# Altium project Printing.PrjPcb (part 1 of 4)
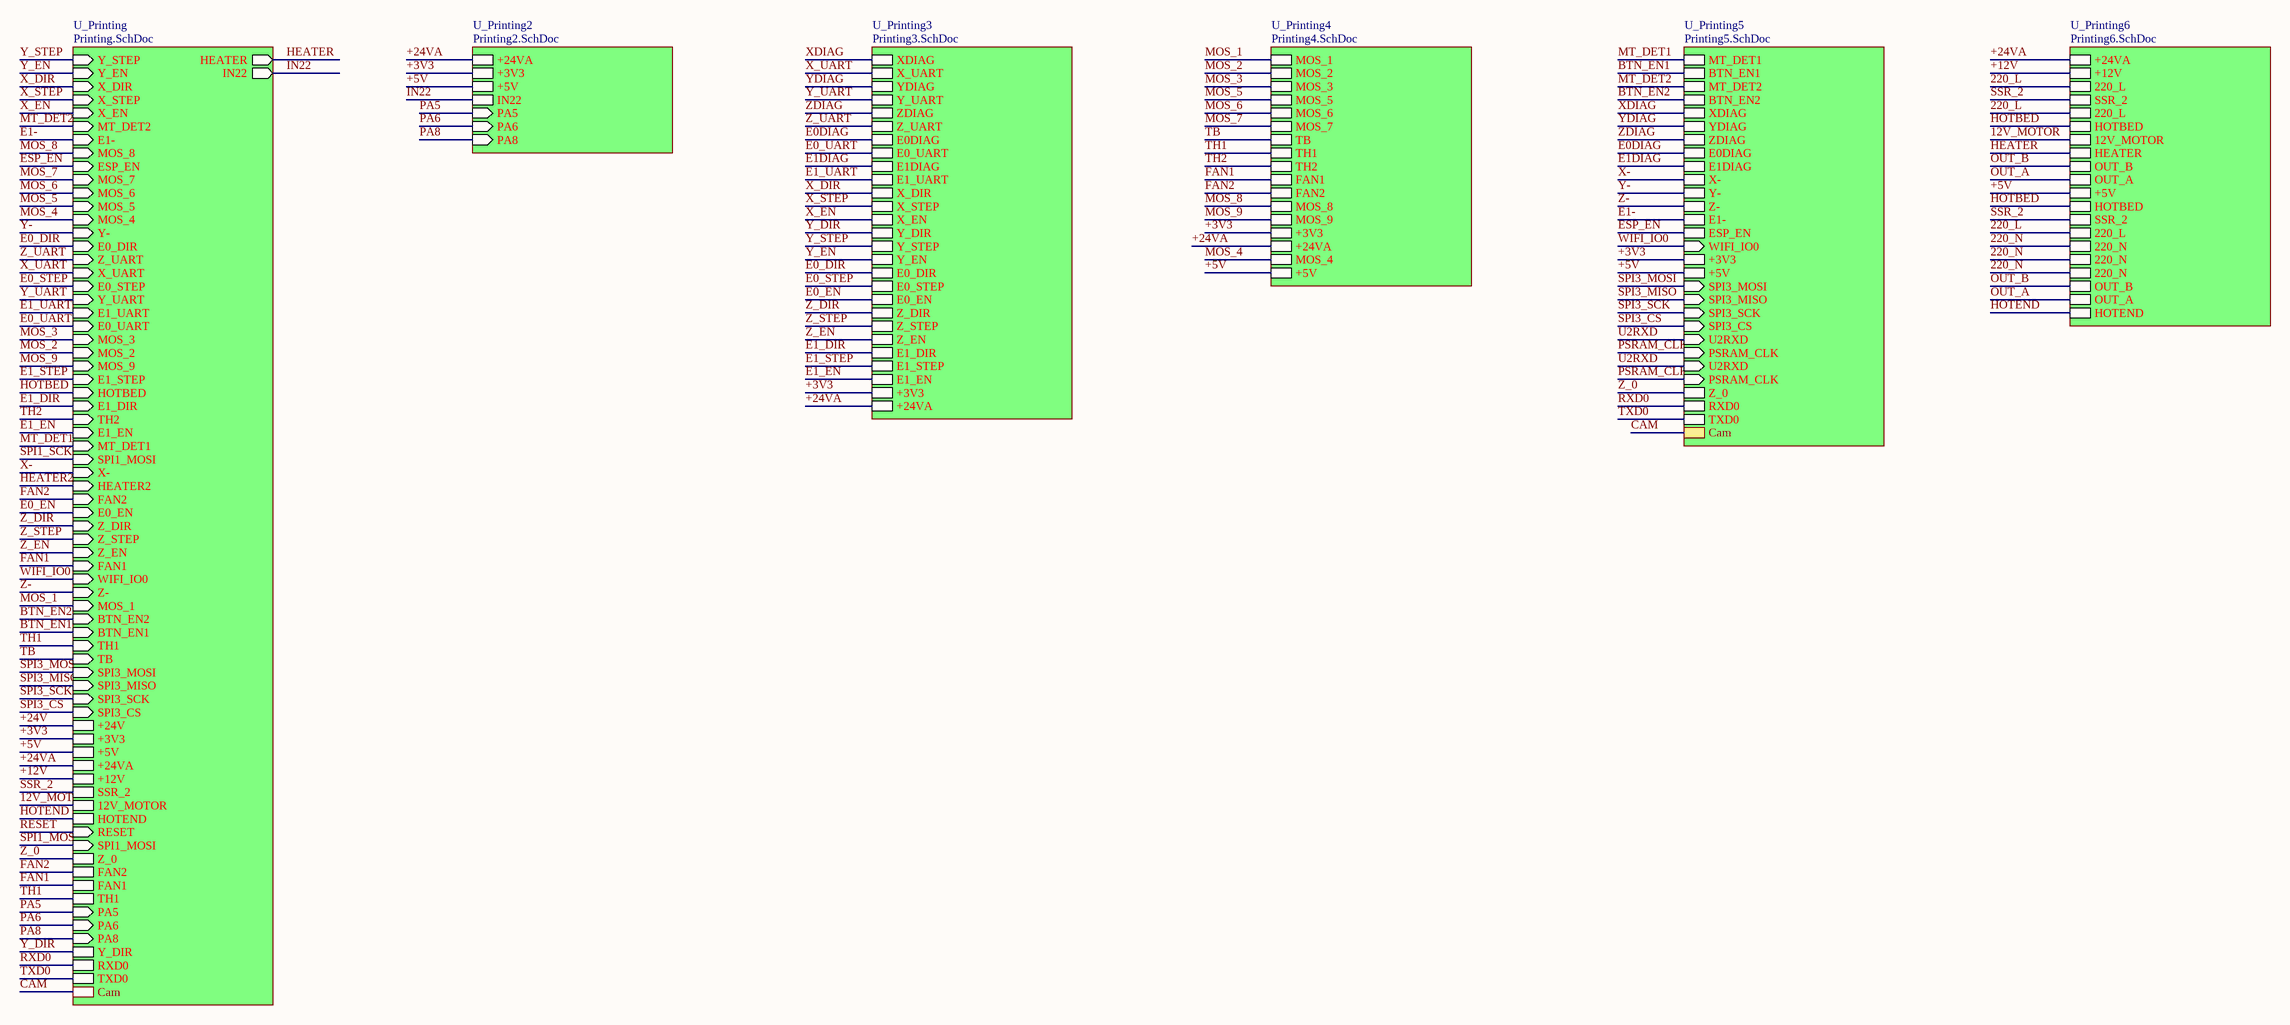
[diagram p0: Main-Sch.SchDoc]
7 sheets, 445 parts. Net scope: hierarchical (ports join the sheet entries above them; power ports are global).
Board files: Printing2.PcbDoc, Printing.PcbDoc
Sheets:
  Main-Sch.SchDoc
    U_Printing2 = Printing2.SchDoc
    U_Printing3 = Printing3.SchDoc
    U_Printing4 = Printing4.SchDoc
    U_Printing6 = Printing6.SchDoc
    U_Printing = Printing.SchDoc
    U_Printing5 = Printing5.SchDoc

## Sheet Main-Sch.SchDoc
size A2; Organization: Altium Limited; Address1: L3, 12a Rodborough Rd; Address2: Frenchs Forest; Address3: NSW; Address4: Australia 2086

### Sub-sheets
U_Printing = Printing.SchDoc: Y_STEP (in), Y_EN (in), X_DIR (in), X_STEP (in), X_EN (in), HEATER (out), MT_DET2 (in), E1- (in), MOS_8 (in), ESP_EN (in), MOS_7 (in), MOS_6 (in), MOS_5 (in), MOS_4 (in), Y- (in), E0_DIR (in), Z_UART (in), X_UART (in), E0_STEP (in), Y_UART (in), E1_UART (in), E0_UART (in), MOS_3 (in), MOS_2 (in), MOS_9 (in), E1_STEP (in), HOTBED (in), E1_DIR (in), TH2 (in), E1_EN (in), MT_DET1 (in), SPI1_MOSI (in), X- (in), HEATER2 (in), FAN2 (in), E0_EN (in), Z_DIR (in), Z_STEP (in), Z_EN (in), FAN1 (in), WIFI_IO0 (in), Z- (in), MOS_1 (in), BTN_EN2 (in), BTN_EN1 (in), TH1 (in), TB (in), IN22 (out), SPI3_MOSI (in), SPI3_MISO (in), SPI3_SCK (in), SPI3_CS (in), +24V, +3V3, +5V, +24VA, +12V, SSR_2, 12V_MOTOR, HOTEND, RESET (in), SPI1_MOSI (in), Z_0, FAN2, FAN1, TH1, PA5 (in), PA6 (in), PA8 (in), Y_DIR, RXD0, TXD0, Cam
U_Printing2 = Printing2.SchDoc: +24VA, +3V3, +5V, IN22, PA5 (in), PA6 (in), PA8 (in)
U_Printing3 = Printing3.SchDoc: XDIAG, X_UART, YDIAG, Y_UART, ZDIAG, Z_UART, E0DIAG, E0_UART, E1DIAG, E1_UART, X_DIR, X_STEP, X_EN, Y_DIR, Y_STEP, Y_EN, E0_DIR, E0_STEP, E0_EN, Z_DIR, Z_STEP, Z_EN, E1_DIR, E1_STEP, E1_EN, +3V3, +24VA
U_Printing4 = Printing4.SchDoc: MOS_1, MOS_2, MOS_3, MOS_5, MOS_6, MOS_7, TB, TH1, TH2, FAN1, FAN2, MOS_8, MOS_9, +3V3, +24VA, MOS_4, +5V
U_Printing5 = Printing5.SchDoc: MT_DET1, BTN_EN1, MT_DET2, BTN_EN2, XDIAG, YDIAG, ZDIAG, E0DIAG, E1DIAG, X-, Y-, Z-, E1-, ESP_EN, WIFI_IO0 (in), +3V3, +5V, SPI3_MOSI (in), SPI3_MISO (in), SPI3_SCK (in), SPI3_CS (in), U2RXD (in), PSRAM_CLK (in), U2RXD (in), PSRAM_CLK (in), Z_0, RXD0, TXD0, Cam
U_Printing6 = Printing6.SchDoc: +24VA, +12V, 220_L, SSR_2, 220_L, HOTBED, 12V_MOTOR, HEATER, OUT_B, OUT_A, +5V, HOTBED, SSR_2, 220_L, 220_N, 220_N, 220_N, OUT_B, OUT_A, HOTEND

### Nets
+3V3: sheet U_Printing2/+3V3, sheet U_Printing3/+3V3, sheet U_Printing4/+3V3, sheet U_Printing/+3V3, sheet U_Printing5/+3V3
+5V: sheet U_Printing2/+5V, sheet U_Printing4/+5V, sheet U_Printing6/+5V, sheet U_Printing/+5V, sheet U_Printing5/+5V
+12V: sheet U_Printing6/+12V, sheet U_Printing/+12V
+24VA: sheet U_Printing2/+24VA, sheet U_Printing3/+24VA, sheet U_Printing4/+24VA, sheet U_Printing6/+24VA, sheet U_Printing/+24VA
12V_MOTOR: sheet U_Printing6/12V_MOTOR, sheet U_Printing/12V_MOTOR
220_L: sheet U_Printing6/220_L, sheet U_Printing6/220_L, sheet U_Printing6/220_L
220_N: sheet U_Printing6/220_N, sheet U_Printing6/220_N, sheet U_Printing6/220_N
BTN_EN1: sheet U_Printing/BTN_EN1, sheet U_Printing5/BTN_EN1
BTN_EN2: sheet U_Printing/BTN_EN2, sheet U_Printing5/BTN_EN2
CAM: sheet U_Printing/Cam, sheet U_Printing5/Cam
E0_DIR: sheet U_Printing3/E0_DIR, sheet U_Printing/E0_DIR
E0_EN: sheet U_Printing3/E0_EN, sheet U_Printing/E0_EN
E0_STEP: sheet U_Printing3/E0_STEP, sheet U_Printing/E0_STEP
E0_UART: sheet U_Printing3/E0_UART, sheet U_Printing/E0_UART
E0DIAG: sheet U_Printing3/E0DIAG, sheet U_Printing5/E0DIAG
E1-: sheet U_Printing/E1-, sheet U_Printing5/E1-
E1_DIR: sheet U_Printing3/E1_DIR, sheet U_Printing/E1_DIR
E1_EN: sheet U_Printing3/E1_EN, sheet U_Printing/E1_EN
E1_STEP: sheet U_Printing3/E1_STEP, sheet U_Printing/E1_STEP
E1_UART: sheet U_Printing3/E1_UART, sheet U_Printing/E1_UART
E1DIAG: sheet U_Printing3/E1DIAG, sheet U_Printing5/E1DIAG
ESP_EN: sheet U_Printing/ESP_EN, sheet U_Printing5/ESP_EN
FAN1: sheet U_Printing4/FAN1, sheet U_Printing/FAN1, sheet U_Printing/FAN1
FAN2: sheet U_Printing4/FAN2, sheet U_Printing/FAN2, sheet U_Printing/FAN2
HEATER: sheet U_Printing6/HEATER, sheet U_Printing/HEATER
HOTBED: sheet U_Printing6/HOTBED, sheet U_Printing6/HOTBED, sheet U_Printing/HOTBED
HOTEND: sheet U_Printing6/HOTEND, sheet U_Printing/HOTEND
IN22: sheet U_Printing2/IN22, sheet U_Printing/IN22
MOS_1: sheet U_Printing4/MOS_1, sheet U_Printing/MOS_1
MOS_2: sheet U_Printing4/MOS_2, sheet U_Printing/MOS_2
MOS_3: sheet U_Printing4/MOS_3, sheet U_Printing/MOS_3
MOS_4: sheet U_Printing4/MOS_4, sheet U_Printing/MOS_4
MOS_5: sheet U_Printing4/MOS_5, sheet U_Printing/MOS_5
MOS_6: sheet U_Printing4/MOS_6, sheet U_Printing/MOS_6
MOS_7: sheet U_Printing4/MOS_7, sheet U_Printing/MOS_7
MOS_8: sheet U_Printing4/MOS_8, sheet U_Printing/MOS_8
MOS_9: sheet U_Printing4/MOS_9, sheet U_Printing/MOS_9
MT_DET1: sheet U_Printing/MT_DET1, sheet U_Printing5/MT_DET1
MT_DET2: sheet U_Printing/MT_DET2, sheet U_Printing5/MT_DET2
OUT_A: sheet U_Printing6/OUT_A, sheet U_Printing6/OUT_A
OUT_B: sheet U_Printing6/OUT_B, sheet U_Printing6/OUT_B
PA5: sheet U_Printing2/PA5, sheet U_Printing/PA5
PA6: sheet U_Printing2/PA6, sheet U_Printing/PA6
PA8: sheet U_Printing2/PA8, sheet U_Printing/PA8
PSRAM_CLK: sheet U_Printing5/PSRAM_CLK, sheet U_Printing5/PSRAM_CLK
RXD0: sheet U_Printing/RXD0, sheet U_Printing5/RXD0
SPI1_MOSI: sheet U_Printing/SPI1_MOSI, sheet U_Printing/SPI1_MOSI  [also labelled SPI1_SCK]
SPI3_CS: sheet U_Printing/SPI3_CS, sheet U_Printing5/SPI3_CS
SPI3_MISO: sheet U_Printing/SPI3_MISO, sheet U_Printing5/SPI3_MISO
SPI3_MOSI: sheet U_Printing/SPI3_MOSI, sheet U_Printing5/SPI3_MOSI
SPI3_SCK: sheet U_Printing/SPI3_SCK, sheet U_Printing5/SPI3_SCK
SSR_2: sheet U_Printing6/SSR_2, sheet U_Printing6/SSR_2, sheet U_Printing/SSR_2
TB: sheet U_Printing4/TB, sheet U_Printing/TB
TH1: sheet U_Printing4/TH1, sheet U_Printing/TH1, sheet U_Printing/TH1
TH2: sheet U_Printing4/TH2, sheet U_Printing/TH2
TXD0: sheet U_Printing/TXD0, sheet U_Printing5/TXD0
U2RXD: sheet U_Printing5/U2RXD, sheet U_Printing5/U2RXD
WIFI_IO0: sheet U_Printing/WIFI_IO0, sheet U_Printing5/WIFI_IO0
X-: sheet U_Printing/X-, sheet U_Printing5/X-
X_DIR: sheet U_Printing3/X_DIR, sheet U_Printing/X_DIR
X_EN: sheet U_Printing3/X_EN, sheet U_Printing/X_EN
X_STEP: sheet U_Printing3/X_STEP, sheet U_Printing/X_STEP
X_UART: sheet U_Printing3/X_UART, sheet U_Printing/X_UART
XDIAG: sheet U_Printing3/XDIAG, sheet U_Printing5/XDIAG
Y-: sheet U_Printing/Y-, sheet U_Printing5/Y-
Y_DIR: sheet U_Printing3/Y_DIR, sheet U_Printing/Y_DIR
Y_EN: sheet U_Printing3/Y_EN, sheet U_Printing/Y_EN
Y_STEP: sheet U_Printing3/Y_STEP, sheet U_Printing/Y_STEP
Y_UART: sheet U_Printing3/Y_UART, sheet U_Printing/Y_UART
YDIAG: sheet U_Printing3/YDIAG, sheet U_Printing5/YDIAG
Z-: sheet U_Printing/Z-, sheet U_Printing5/Z-
Z_0: sheet U_Printing/Z_0, sheet U_Printing5/Z_0
Z_DIR: sheet U_Printing3/Z_DIR, sheet U_Printing/Z_DIR
Z_EN: sheet U_Printing3/Z_EN, sheet U_Printing/Z_EN
Z_STEP: sheet U_Printing3/Z_STEP, sheet U_Printing/Z_STEP
Z_UART: sheet U_Printing3/Z_UART, sheet U_Printing/Z_UART
ZDIAG: sheet U_Printing3/ZDIAG, sheet U_Printing5/ZDIAG

### Notes on the sheet
- Title
- Size:
- Date:
- File:
- A2
- Number:
- Time:
- Revision:
- Sheet
- of

## Sheet Printing2.SchDoc
size A3; Organization: Altium Limited; Address1: L3, 12a Rodborough Rd; Address2: Frenchs Forest; Address3: NSW; Address4: Australia 2086
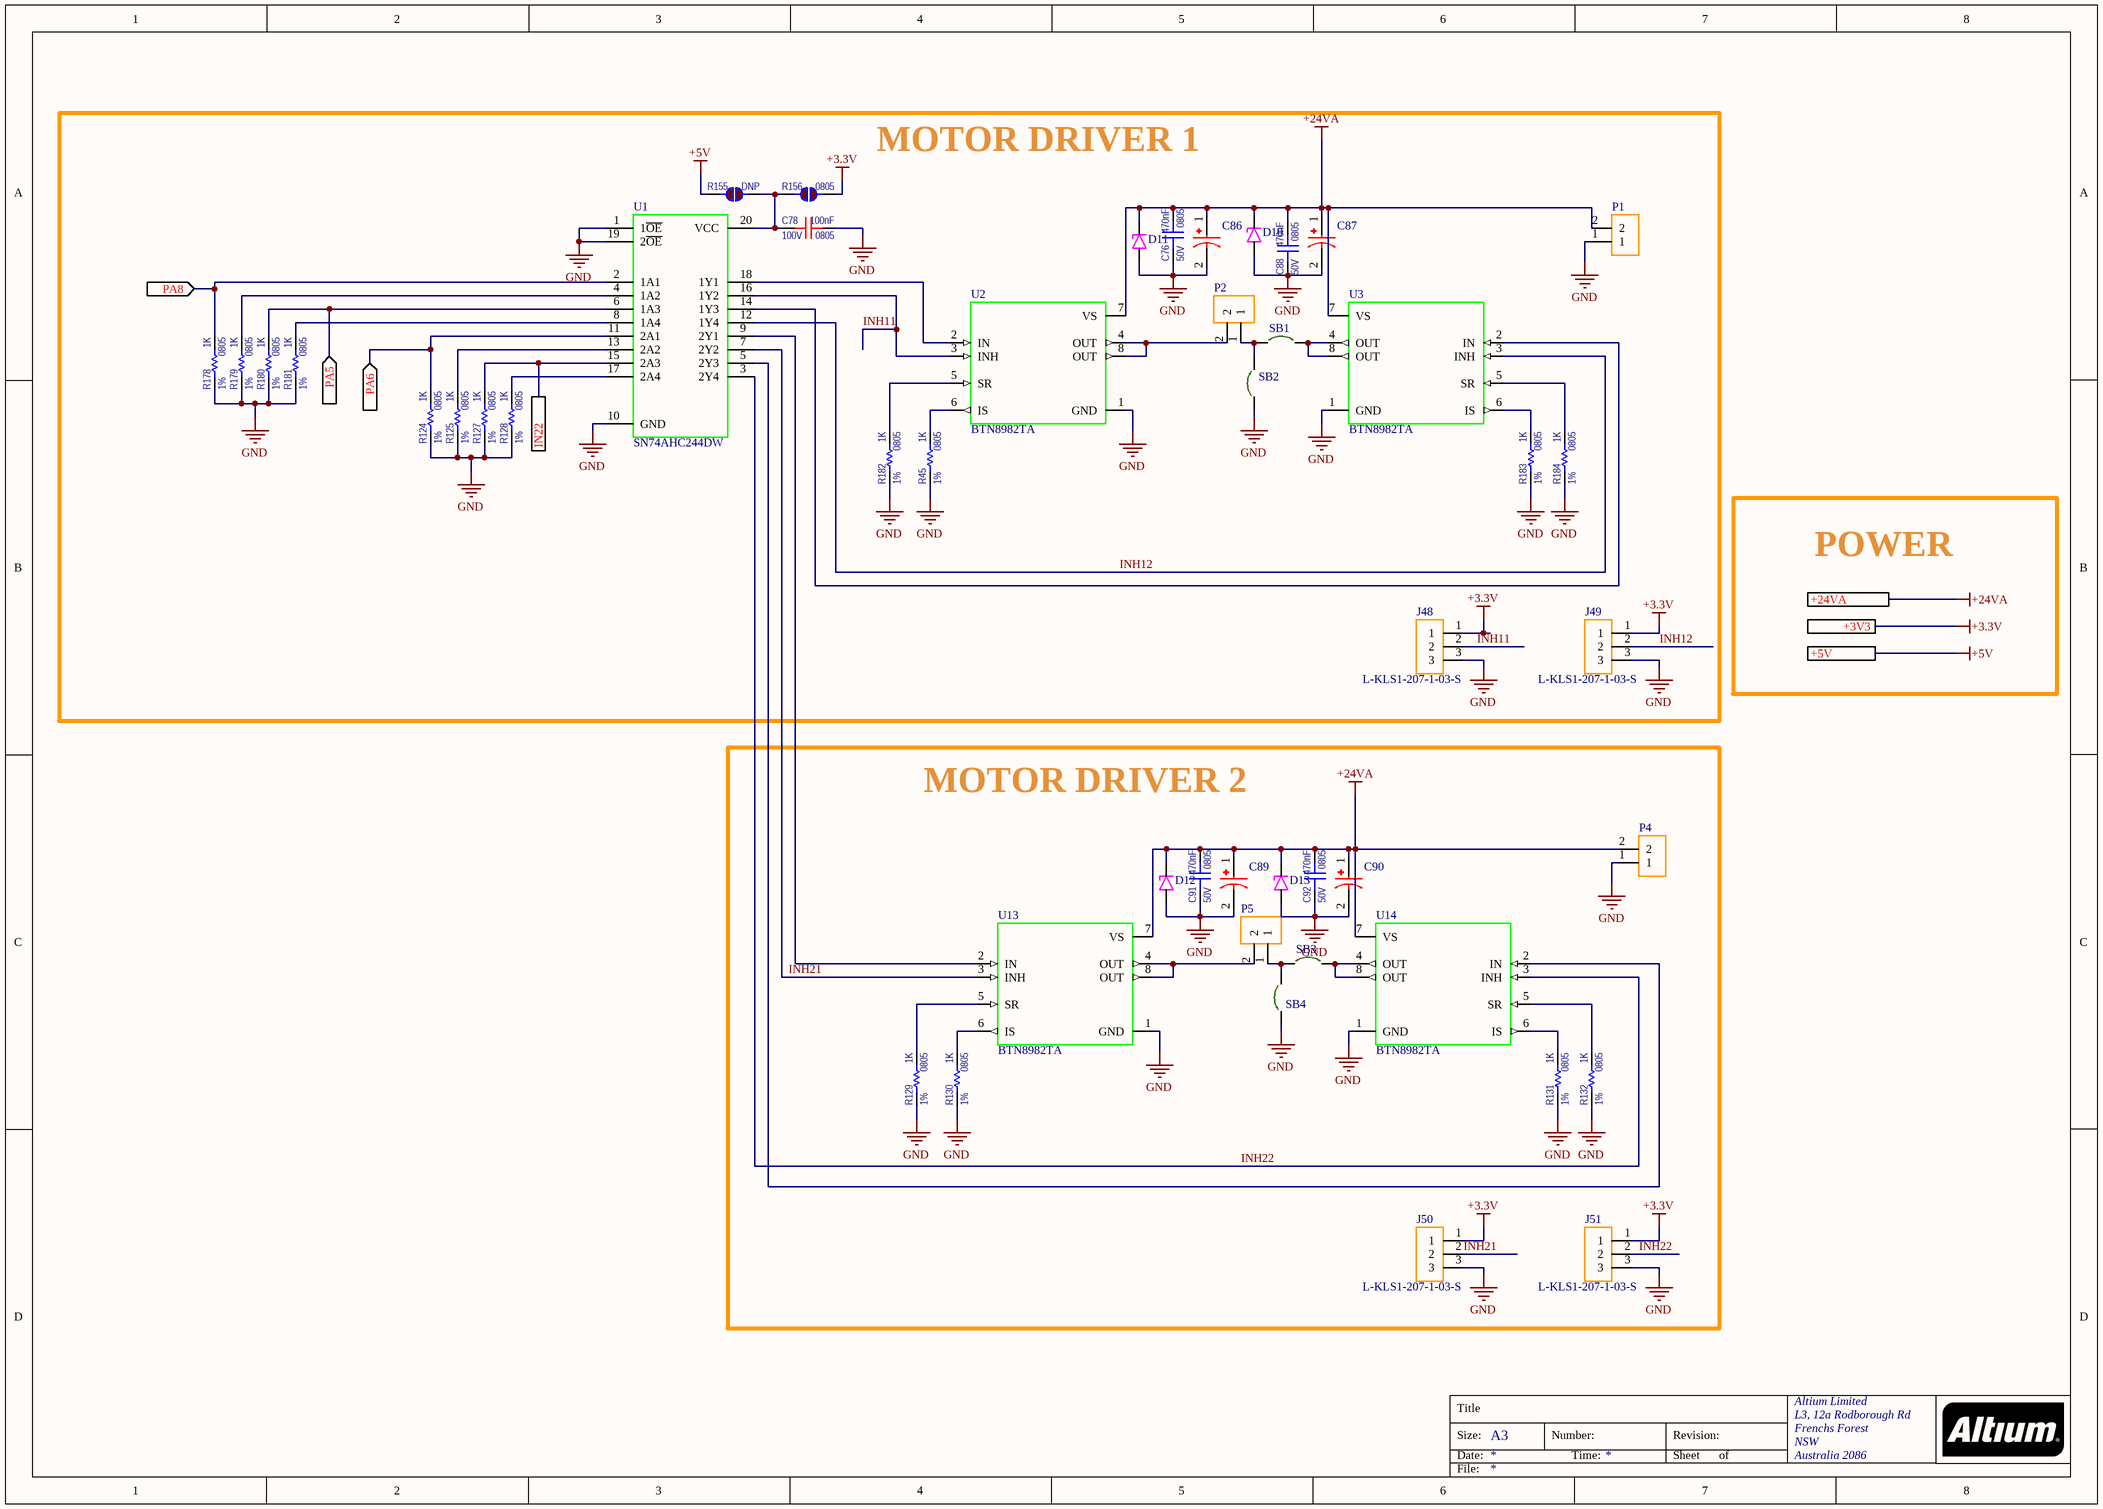
[diagram p1: Printing2.SchDoc]

### Parts
C76  value 470nF  Voltage: 50V  Package: 0805  [C_0805_GEN_1.10H]  (hidden comment: Capacitor)
C78  value 100nF  Voltage: 100V  Package: 0805  [C_0805_GEN_1.40H]  (hidden comment: ESDSafeCapacitor)
C86  100uF/50V  [SC1V107M6L07KVR]  (value not drawn)
C87  100uF/50V  [SC1V107M6L07KVR]  (value not drawn)
C88  value 470nF  Voltage: 50V  Package: 0805  [C_0805_GEN_1.10H]  (hidden comment: Capacitor)
C89  100uF/50V  [SC1V107M6L07KVR]  (value not drawn)
C90  100uF/50V  [SC1V107M6L07KVR]  (value not drawn)
C91  value 470nF  Voltage: 50V  Package: 0805  [C_0805_GEN_1.10H]  (hidden comment: Capacitor)
C92  value 470nF  Voltage: 50V  Package: 0805  [C_0805_GEN_1.10H]  (hidden comment: Capacitor)
D10  SMBJ30A-E3/52  [S2G_R1_00001]  (value not drawn)
D11  SMBJ30A-E3/52  [S2G_R1_00001]  (value not drawn)
D12  SMBJ30A-E3/52  [S2G_R1_00001]  (value not drawn)
D13  SMBJ30A-E3/52  [S2G_R1_00001]  (value not drawn)
J48  L-KLS1-207-1-03-S  [L-KLS1-207-1-03-S]
J49  L-KLS1-207-1-03-S  [L-KLS1-207-1-03-S]
J50  L-KLS1-207-1-03-S  [L-KLS1-207-1-03-S]
J51  L-KLS1-207-1-03-S  [L-KLS1-207-1-03-S]
P1  5.08 Klemens  [5.08 Klemens]  (value not drawn)
P2  5.08 Klemens  [5.08 Klemens]  (value not drawn)
P4  5.08 Klemens  [5.08 Klemens]  (value not drawn)
P5  5.08 Klemens  [5.08 Klemens]  (value not drawn)
R45  value 1K  Tolerance: 1%  Package: 0805  [R_0805_GEN_0.70H]  (hidden comment: StandardResistor)
R124  value 1K  Tolerance: 1%  Package: 0805  [R_0805_GEN_0.70H]  (hidden comment: StandardResistor)
R125  value 1K  Tolerance: 1%  Package: 0805  [R_0805_GEN_0.70H]  (hidden comment: StandardResistor)
R127  value 1K  Tolerance: 1%  Package: 0805  [R_0805_GEN_0.70H]  (hidden comment: StandardResistor)
R128  value 1K  Tolerance: 1%  Package: 0805  [R_0805_GEN_0.70H]  (hidden comment: StandardResistor)
R129  value 1K  Tolerance: 1%  Package: 0805  [R_0805_GEN_0.70H]  (hidden comment: StandardResistor)
R130  value 1K  Tolerance: 1%  Package: 0805  [R_0805_GEN_0.70H]  (hidden comment: StandardResistor)
R131  value 1K  Tolerance: 1%  Package: 0805  [R_0805_GEN_0.70H]  (hidden comment: StandardResistor)
R132  value 1K  Tolerance: 1%  Package: 0805  [R_0805_GEN_0.70H]  (hidden comment: StandardResistor)
R155  Package: DNP  [R_0805_GEN_0.70H]  (hidden comment: StandardJumper)
R156  Package: 0805  [R_0805_GEN_0.70H]  (hidden comment: StandardJumper)
R178  value 1K  Tolerance: 1%  Package: 0805  [R_0805_GEN_0.70H]  (hidden comment: StandardResistor)
R179  value 1K  Tolerance: 1%  Package: 0805  [R_0805_GEN_0.70H]  (hidden comment: StandardResistor)
R180  value 1K  Tolerance: 1%  Package: 0805  [R_0805_GEN_0.70H]  (hidden comment: StandardResistor)
R181  value 1K  Tolerance: 1%  Package: 0805  [R_0805_GEN_0.70H]  (hidden comment: StandardResistor)
R182  value 1K  Tolerance: 1%  Package: 0805  [R_0805_GEN_0.70H]  (hidden comment: StandardResistor)
R183  value 1K  Tolerance: 1%  Package: 0805  [R_0805_GEN_0.70H]  (hidden comment: StandardResistor)
R184  value 1K  Tolerance: 1%  Package: 0805  [R_0805_GEN_0.70H]  (hidden comment: StandardResistor)
SB1  (no value)  [0805_SB]
SB2  0805_SB  [0805_SB]  (value not drawn)
SB3  (no value)  [0805_SB]
SB4  (no value)  [0805_SB]
U1  SN74AHC244DW  [SN74AHC244DW]
U2  BTN8982TA  [DPAK127P1500X440-8N]
U3  BTN8982TA  [DPAK127P1500X440-8N]
U13  BTN8982TA  [DPAK127P1500X440-8N]
U14  BTN8982TA  [DPAK127P1500X440-8N]

### Blocks framed on the sheet
MOTOR DRIVER 1: C76 C78 C86-C88 D10 D11 J48 J49 P1 P2 R45 R124 R125 R127 R128 R155 R156 R178-R184 SB1 SB2 U1-U3
MOTOR DRIVER 2: C89-C92 D12 D13 J50 J51 P4 P5 R129-R132 SB3 SB4 U13 U14

### Ports
+3V3, +5V, +24VA, IN22, PA5 (in), PA6 (in), PA8 (in)

### Nets
+3.3V: J48.1 J49.1 J50.1 J51.1 R156.2 ; port +3V3  [project net +3V3]
+5V: R155.1 ; port +5V
+24VA: C76.2 C86.1 C87.1 C88.2 C89.1 C90.1 C91.2 C92.2 D10.K D11.K D12.K D13.K P1.2 P4.2 U2.7(VS) U3.7(VS) U13.7(VS) U14.7(VS) ; port +24VA
GND: C76.1 C78.2 C86.2 C87.2 C88.1 C89.2 C90.2 C91.1 C92.1 D10.A D11.A D12.A D13.A J48.3 J49.3 J50.3 J51.3 P1.1 P4.1 R45.1 R124.1 R125.1 R127.1 R128.1 R129.1 R130.1 R131.1 R132.1 R178.1 R179.1 R180.1 R181.1 R182.1 R183.1 R184.1 SB2.1 SB4.1 U1.1(1~{OE}) U1.10(GND) U1.19(2~{OE}) U2.1(GND) U3.1(GND) U13.1(GND) U14.1(GND)
IN22: R127.2 U1.15(2A3) ; port IN22
INH11: J48.2 U1.16(1Y2) U2.3(INH)
INH12: J49.2 U1.12(1Y4) U3.3(INH)
INH21: J50.2 U1.7(2Y2) U13.3(INH)
INH22: J51.2 U1.3(2Y4) U14.3(INH)
PA5: R180.2 U1.6(1A3) ; port PA5
PA6: R124.2 U1.11(2A1) ; port PA6
PA8: R178.2 U1.2(1A1) ; port PA8
NetC78_1: C78.1 R155.2 R156.1 U1.20(VCC)
NetP2_1: P2.1 SB1.1 SB2.2
NetP2_2: P2.2 U2.4(OUT) U2.8(OUT)
NetP5_1: P5.1 SB3.1 SB4.2
NetP5_2: P5.2 U13.4(OUT) U13.8(OUT)
NetR45_2: R45.2 U2.6(IS)
NetR125_2: R125.2 U1.13(2A2)
NetR128_2: R128.2 U1.17(2A4)
NetR129_2: R129.2 U13.5(SR)
NetR130_2: R130.2 U13.6(IS)
NetR131_2: R131.2 U14.6(IS)
NetR132_2: R132.2 U14.5(SR)
NetR179_2: R179.2 U1.4(1A2)
NetR181_2: R181.2 U1.8(1A4)
NetR182_2: R182.2 U2.5(SR)
NetR183_2: R183.2 U3.6(IS)
NetR184_2: R184.2 U3.5(SR)
NetSB1_2: SB1.2 U3.4(OUT) U3.8(OUT)
NetSB3_2: SB3.2 U14.4(OUT) U14.8(OUT)
NetU1_5: U1.5(2Y3) U14.2(IN)
NetU1_9: U1.9(2Y1) U13.2(IN)
NetU1_14: U1.14(1Y3) U3.2(IN)
NetU1_18: U1.18(1Y1) U2.2(IN)

### Notes on the sheet
- POWER
- Title
- Size:
- Date:
- A3
- Number:
- Time:
- Revision:
- Sheet
- of
- File:

### Library data of the parts
C76 C88 C91 C92 = CER_470nF_#2: CAP_CER_470nF_50V_X7R_10%_0805; Manufacturer#1: Kemet; Manufacturer#1 PN: C0805C474K5RACAUTO; Manufacturer#2 PN: GCM21BR71H474KA55; Similar Part: CL21B474KBFVPNE; Added by: SonerI; FireANTs Code: C00122; Grade Level: Automotive; Lead Status: Pb-Free; Location: 3F6; Max Reflow Duration: 30; Max Reflow Temp: 260; Placement Area: 10.45; Power Rating: X; Temp# Operating: -55°C/+125°C; Tolerance: 10%; Identifier: CER_470nF_#2; Checked by: İlkerU; ComponentLink1Description: Resource Folder; ComponentLink1URL: C:\FireANTs_Repo\HW_Lib\trunk\ComponentLibrary\Resources\Capacitors\C00122; Cost: 0.32; Current: N/A; Failure in Time: N/A; Features: AEC-Q200; Height: 1.10; Manufacturer#2: Murata; MSL: 1; Mounting Type: SMD; Part Status: Active; Temp# Storage: N/A; Weight: 17mg
C78 = CER_100nF_#4: CAP_CER_100nF_100V_X7R_10%_0805; Manufacturer#1: Kemet; Manufacturer#1 PN: C0805C104K1RECAUTO; Manufacturer#2 PN: ESD51C104K4T2A-24; Similar Part: C0805C104J1RECAUTO7210; C0805X104J1RECAUTO; Added by: İlhanT; FireANTs Code: C00062; Grade Level: Automotive; Lead Status: Pb-Free; Location: 3B16; Max Reflow Duration: 30; Max Reflow Temp: 260; Placement Area: 10.45; Power Rating: X; Temp# Operating: -55°C/+125°C; Tolerance: 10%; Identifier: CER_100nF_#4; Checked by: İlkerU; ComponentLink1Description: Resource Folder; ComponentLink1URL: C:\FireANTs_Repo\HW_Lib\trunk\ComponentLibrary\Resources\Capacitors\C00062; Cost: 0.27; Current: N/A; Failure in Time: N/A; Features: AEC-Q200; ESD withstanding; Height: 1.40; Manufacturer#2: AVX; MSL: 1; Mounting Type: SMD; Part Status: Active; Temp# Storage: N/A; Weight: 19mg
C86 C87 C89 C90 = SC1V107M6L07KVR
D10-D13 = SMBJ30A-E3/52: TVS DIODE 30VWM 48.4VC SMB; Manufacturer: Vishay Semiconductors; Breakdown Voltage: 36.8V; Number of Elements: 1; Direction: Unidirectional; Reverse Breakdown Voltage: 33.3V; Operating Supply Voltage: 30V; Max Surge Current: 12.4A; Clamping Voltage: 48.4V; Peak Pulse Power: 600W; Test Current: 1mA; Max Reverse Leakage Current: 1uA; Element Configuration: Single; Power Line Protection: No; Diode Type: ZENER; Supplier 1: Rs; Manufacturer Part Number: SMBJ30A-E3/52; RoHS: Yes; Category: TVS Diodes; Stock 1: 1; Mount: Surface Mount; Case/Package: DO-214AA; Number of Pins: 2; Min Operating Temperature: -55°C; Max Operating Temperature: 150°C; Packaging: Tape and Reel; Package Quantity: 750; Reverse Standoff Voltage: 30V; Polarity: Unidirectional; Number of Channels: 1; Peak Pulse Current: 12.4A; Min Breakdown Voltage: 33.3V; Max Breakdown Voltage: 36.8V; Max Power Dissipation: 600W; Power Dissipation: 600W; Leakage Current: 1uA; Clamping Voltage-Max: 48.4V; Termination: SMD/SMT; Resistor Type: Zener; Number of Unidirectional Channels: 1; Series: TransZorb®; Length: 4.57mm; Width: 3.94mm; Height: 2.24mm; Radiation Hardening: No; Lead Free: Lead Free; RoHS Compliant: Yes; ComponentLink1URL: https://datasheet.ciiva.com/28654/1691222-28654369.pdf?src-supplier=Element14; ComponentLink1Description: https://datasheet.ciiva.com/28654/1691222-28654369.pdf?src-supplier=Element14; ComponentLink2URL: https://datasheet.ciiva.com/26322/139043-26322383.pdf?src-supplier=Element14; ComponentLink2Description: https://datasheet.ciiva.com/26322/139043-26322383.pdf?src-supplier=Element14; ComponentLink3URL: https://datasheet.ciiva.com/26322/139043-26322382.pdf?src-supplier=Element14; ComponentLink3Description: https://datasheet.ciiva.com/26322/139043-26322382.pdf?src-supplier=Element14; ComponentLink4URL: https://datasheet.ciiva.com/330/smbj50a-330951.pdf?src-supplier=Digi-Key; ComponentLink4Description: https://datasheet.ciiva.com/330/smbj50a-330951.pdf?src-supplier=Digi-Key; ComponentLink5URL: https://datasheet.ciiva.com/330/smbj50a-330952.pdf?src-supplier=Digi-Key; ComponentLink5Description: https://datasheet.ciiva.com/330/smbj50a-330952.pdf?src-supplier=Digi-Key; ComponentLink6URL: https://datasheet.ciiva.com/330/smbj50a-330950.pdf?src-supplier=Digi-Key; ComponentLink6Description: https://datasheet.ciiva.com/330/smbj50a-330950.pdf?src-supplier=Digi-Key; Supplier Part Number 1: 0229762P
R45 R124 R125 R127-R132 R178-R184 = STD_1K_#2: RES_STD_1K_0.125W_1%_100ppm_0805; Manufacturer#1: Yageo; Manufacturer#1 PN: AC0805FR-071KL; Manufacturer#2 PN: ERJ-6ENF1001V; Added by: SonerI; FireANTs Code: R00102; Current: X; Grade Level: Automotive; Lead Status: Pb-Free; Location: 2F1; Max Reflow Duration: 10; Max Reflow Temp: 260; Placement Area: 10.45; Power Rating: 125mW; Temp# Operating: -55°C/+155°C; Voltage: 150V; Identifier: STD_1K_#2; Checked by: YasinY; ComponentLink1Description: Resource Folder; ComponentLink1URL: C:\FireANTs_Repo\HW_Lib\trunk\ComponentLibrary\Resources\Resistors\R00102; Cost: 0.10; Failure in Time: N/A; Features: AEC-Q200; Height: 0.70; Manufacturer#2: Panasonic; MSL: 1; Mounting Type: SMD; Part Status: Active; Similar Part: N/A; Temp# Storage: N/A; Weight: 5.5mg
R155 R156 = STD_JUMPER_#3: RES_STD_0R_0.125W_0805; Manufacturer#1: Yageo; Manufacturer#1 PN: AC0805JR-070RL; Manufacturer#2 PN: ERJ-6GEY0R00V; Value: 0R; Added by: İlhanT; FireANTs Code: R00008; Current: X; Grade Level: Automotive; Lead Status: Pb-Free; Location: 2D2; Max Reflow Duration: 10; Max Reflow Temp: 260; Placement Area: 10.45; Power Rating: 125mW; Temp# Operating: -55°C/+155°C; Tolerance: 5%; Voltage: 150V; Identifier: STD_JUMPER_#3; Checked by: YasinY; ComponentLink1Description: Resource Folder; ComponentLink1URL: C:\FireANTs_Repo\HW_Lib\trunk\ComponentLibrary\Resources\Resistors\R00008; Cost: 0.10; Failure in Time: N/A; Features: AEC-Q200; Height: 0.70; Manufacturer#2: Panasonic; MSL: 1; Mounting Type: SMD; Part Status: Active; Similar Part: N/A; Temp# Storage: N/A; Weight: 5.5mg
SB1 SB3 SB4 = 0805_SB
U1 = SN74AHC244DW: Buffer/Line Driver 8-CH Non-Inverting 3-ST CMOS 20-Pin SOIC Tube; Manufacturer: Texas Instruments; Number of Channels: 8; Max Supply Voltage: 5.5V; Min Supply Voltage: 2V; Propagation Delay: 16ns; Number of Elements: 2; Logic Function: Buffer,Inverting; Number of Bits per Element: 4; High Level Output Current: -8mA; Low Level Output Current: 8mA; Turn-On Delay Time: 11.9ns; Quiescent Current: 4uA; Output Type: 3-STATE; Supplier 1: Arrow Electronics; Manufacturer Part Number: SN74AHC244DW; RoHS: Yes; Category: Buffers, Drivers and Transceivers; Stock 1: 5; Pricing 1: 1=0,84130, 10=0,80590, 25=0,78200, 50=0,77410, 100=0,71270, 250=0,68820, 500=0,54870 (USD); Mount: Surface Mount; Case/Package: SOIC; Number of Pins: 20; Min Operating Temperature: -40°C; Max Operating Temperature: 85°C; Number of Inputs: 8; Number of Outputs: 8; Packaging: Rail/Tube; Package Quantity: 25; Number of Input Lines: 8; Number of Output Lines: 8; Polarity: Non-Inverting; Series: 74AHC; Technology: CMOS; Number of Bits: 8; Termination: SMD/SMT; Number of Circuits: 8; Length: 12.8mm; Width: 7.52mm; Height: 2.35mm; Radiation Hardening: No; Lead Free: Lead Free; RoHS Compliant: Yes; Reach SVHC Compliant: Yes; ComponentLink1URL: https://datasheet.ciiva.com/1620/sn74ahc244-1620321.pdf?src-supplier=Newark; ComponentLink1Description: https://datasheet.ciiva.com/1620/sn74ahc244-1620321.pdf?src-supplier=Newark; ComponentLink2URL: https://datasheet.ciiva.com/15094/getdatasheetpartid-49308-15094305.pdf?src-supplier=Verical; ComponentLink2Description: https://datasheet.ciiva.com/15094/getdatasheetpartid-49308-15094305.pdf?src-supplier=Verical; ComponentLink3URL: https://datasheet.ciiva.com/7748/1815001-7748028.pdf?src-supplier=Element14; ComponentLink3Description: https://datasheet.ciiva.com/7748/1815001-7748028.pdf?src-supplier=Element14; ComponentLink4URL: https://datasheet.ciiva.com/1835/sn74ahc244-1835217.pdf?src-supplier=Digi-Key; ComponentLink4Description: https://datasheet.ciiva.com/1835/sn74ahc244-1835217.pdf?src-supplier=Digi-Key; ComponentLink5URL: https://datasheet.ciiva.com/14301/sn54ahc244-14301307.pdf?src-supplier=Avnet; ComponentLink5Description: https://datasheet.ciiva.com/14301/sn54ahc244-14301307.pdf?src-supplier=Avnet; Supplier Part Number 1: SN74AHC244DW
U2 U3 U13 U14 = BTN8982TA: Motor / Motion / Ignition Controllers & Drivers TRILITH IC / NOVALITH IC; MF: Infineon Technologies; Price: None; Availability: In Stock; MP: BTN8982TA; Package: TO-263-8 Infineon Technologies; SnapEDA_Link: https://www.snapeda.com/parts/BTN8982TA/Infineon+Technologies/view-part/?ref=snap; Check_prices: https://www.snapeda.com/parts/BTN8982TA/Infineon+Technologies/view-part/?ref=eda; Value: *; Purchase-URL: https://pricing.snapeda.com/search/part/BTN8982TA/?ref=eda

## Sheet Printing3.SchDoc
size A3
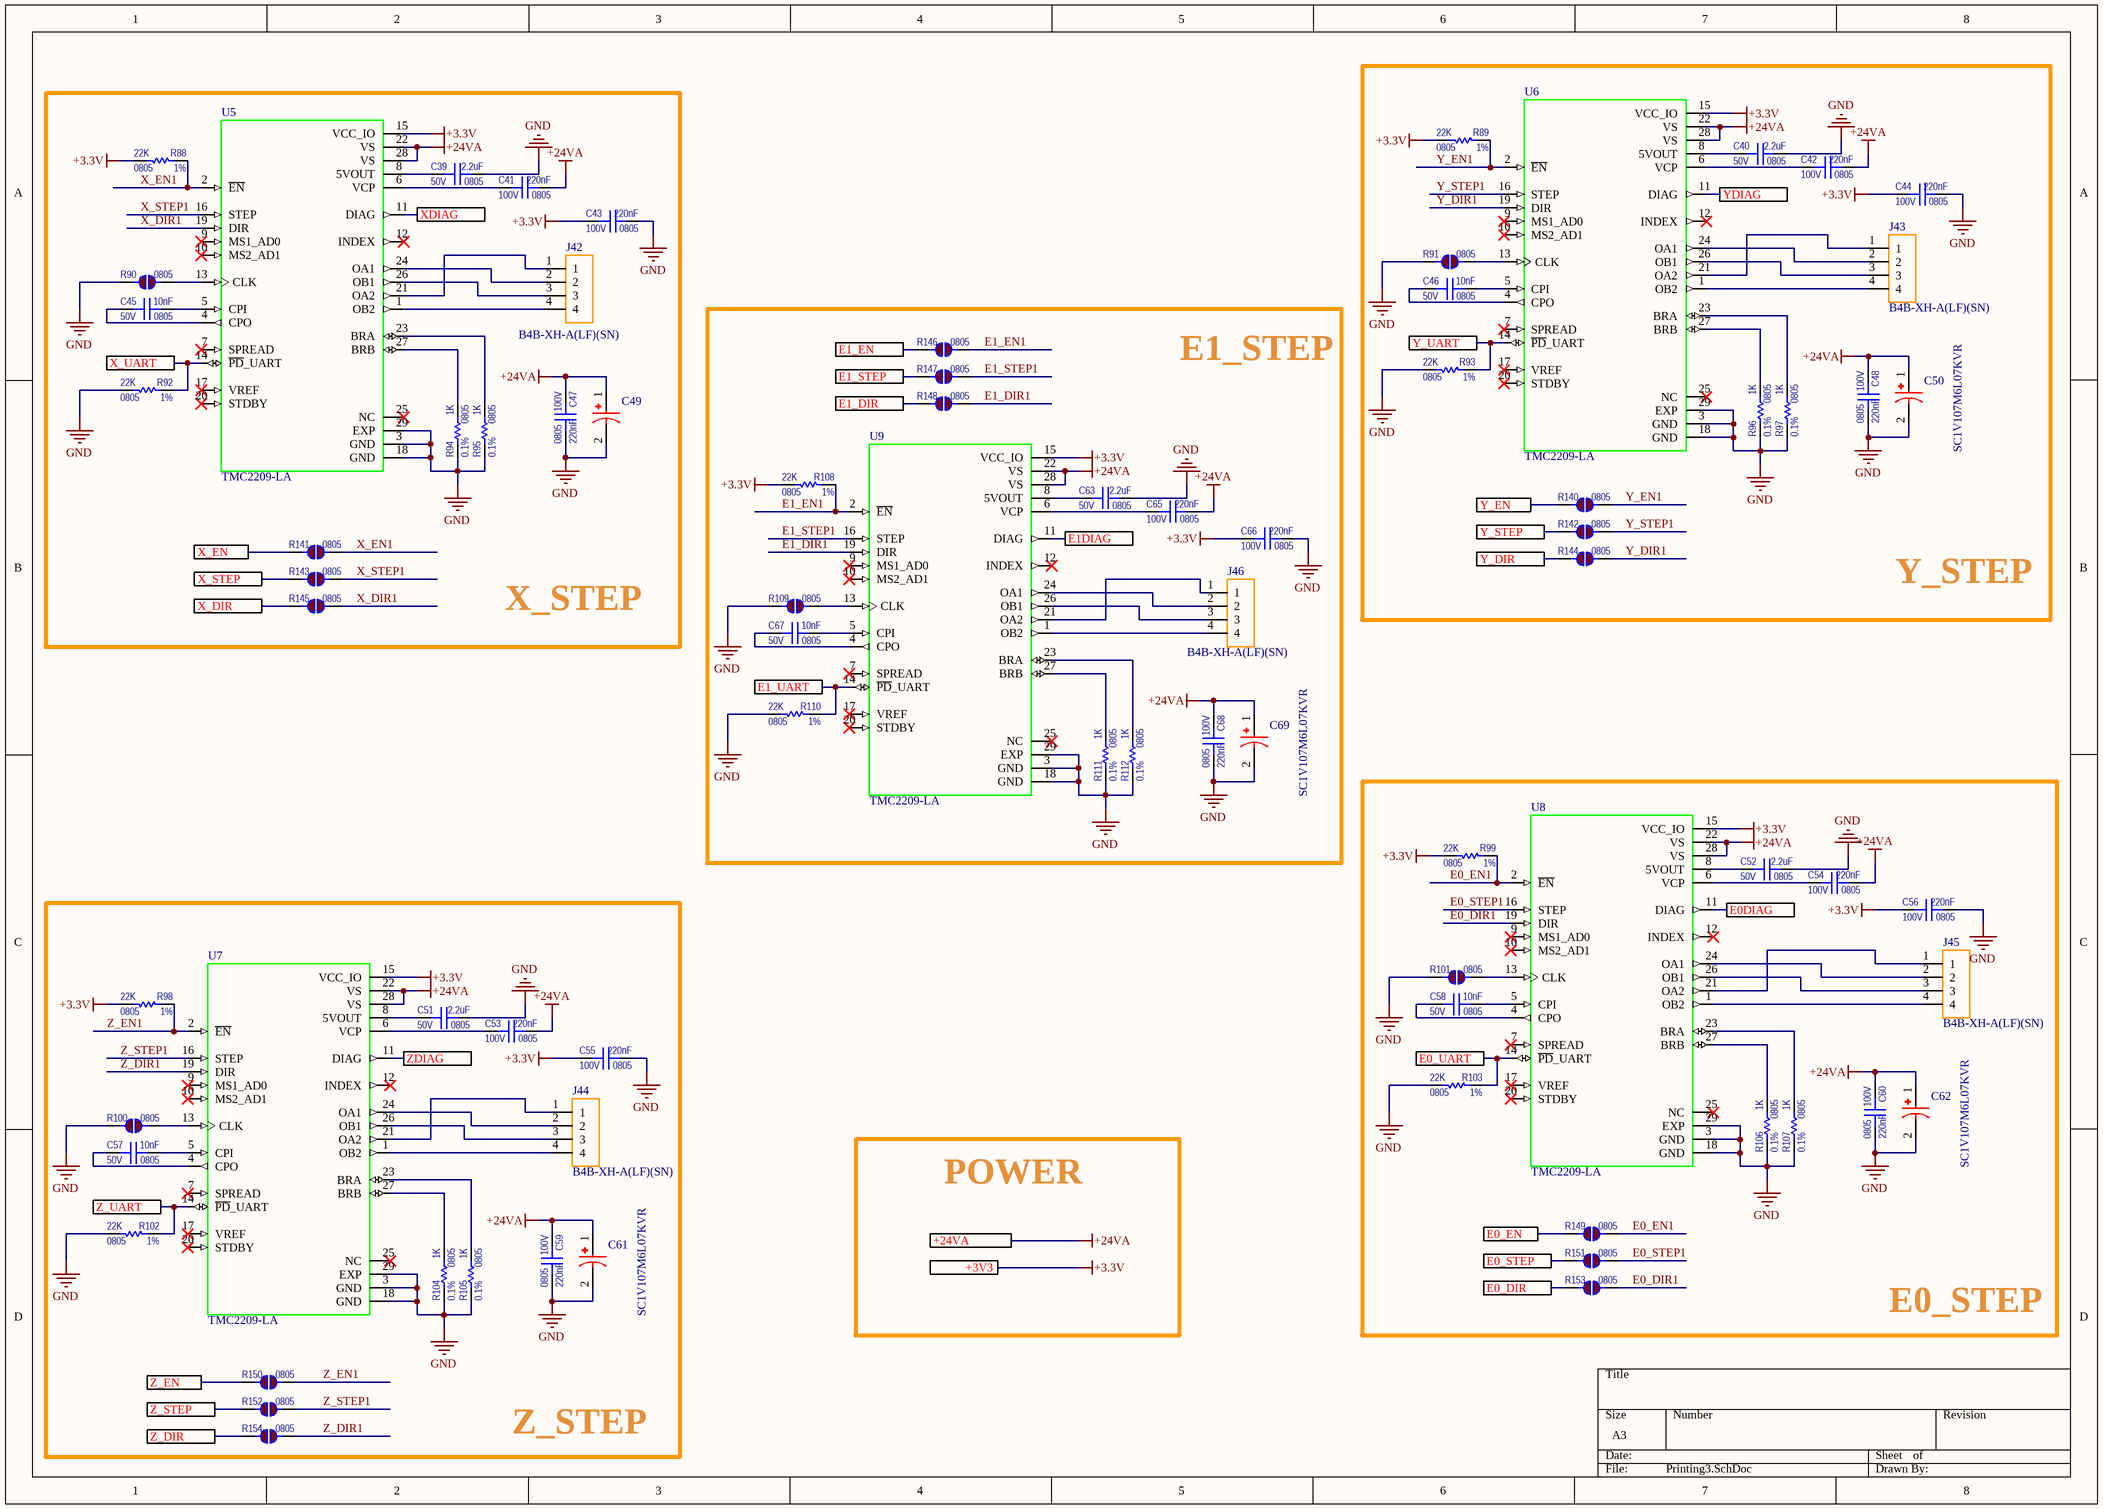
[diagram p2: Printing3.SchDoc]

### Parts
C39  value 2.2uF  Voltage: 50V  Package: 0805  [C_0805_GEN_1.40H]  (hidden comment: Capacitor)
C40  value 2.2uF  Voltage: 50V  Package: 0805  [C_0805_GEN_1.40H]  (hidden comment: Capacitor)
C41  value 220nF  Voltage: 100V  Package: 0805  [C_0805_GEN_1.40H]  (hidden comment: Capacitor)
C42  value 220nF  Voltage: 100V  Package: 0805  [C_0805_GEN_1.40H]  (hidden comment: Capacitor)
C43  value 220nF  Voltage: 100V  Package: 0805  [C_0805_GEN_1.40H]  (hidden comment: Capacitor)
C44  value 220nF  Voltage: 100V  Package: 0805  [C_0805_GEN_1.40H]  (hidden comment: Capacitor)
C45  value 10nF  Voltage: 50V  Package: 0805  [C_0805_GEN_1.10H]  (hidden comment: Capacitor)
C46  value 10nF  Voltage: 50V  Package: 0805  [C_0805_GEN_1.10H]  (hidden comment: Capacitor)
C47  value 220nF  Voltage: 100V  Package: 0805  [C_0805_GEN_1.40H]  (hidden comment: Capacitor)
C48  value 220nF  Voltage: 100V  Package: 0805  [C_0805_GEN_1.40H]  (hidden comment: Capacitor)
C49  SC1V107M6L07KVR  [SC1V107M6L07KVR]  (value not drawn)
C50  SC1V107M6L07KVR  [SC1V107M6L07KVR]
C51  value 2.2uF  Voltage: 50V  Package: 0805  [C_0805_GEN_1.40H]  (hidden comment: Capacitor)
C52  value 2.2uF  Voltage: 50V  Package: 0805  [C_0805_GEN_1.40H]  (hidden comment: Capacitor)
C53  value 220nF  Voltage: 100V  Package: 0805  [C_0805_GEN_1.40H]  (hidden comment: Capacitor)
C54  value 220nF  Voltage: 100V  Package: 0805  [C_0805_GEN_1.40H]  (hidden comment: Capacitor)
C55  value 220nF  Voltage: 100V  Package: 0805  [C_0805_GEN_1.40H]  (hidden comment: Capacitor)
C56  value 220nF  Voltage: 100V  Package: 0805  [C_0805_GEN_1.40H]  (hidden comment: Capacitor)
C57  value 10nF  Voltage: 50V  Package: 0805  [C_0805_GEN_1.10H]  (hidden comment: Capacitor)
C58  value 10nF  Voltage: 50V  Package: 0805  [C_0805_GEN_1.10H]  (hidden comment: Capacitor)
C59  value 220nF  Voltage: 100V  Package: 0805  [C_0805_GEN_1.40H]  (hidden comment: Capacitor)
C60  value 220nF  Voltage: 100V  Package: 0805  [C_0805_GEN_1.40H]  (hidden comment: Capacitor)
C61  SC1V107M6L07KVR  [SC1V107M6L07KVR]
C62  SC1V107M6L07KVR  [SC1V107M6L07KVR]
C63  value 2.2uF  Voltage: 50V  Package: 0805  [C_0805_GEN_1.40H]  (hidden comment: Capacitor)
C65  value 220nF  Voltage: 100V  Package: 0805  [C_0805_GEN_1.40H]  (hidden comment: Capacitor)
C66  value 220nF  Voltage: 100V  Package: 0805  [C_0805_GEN_1.40H]  (hidden comment: Capacitor)
C67  value 10nF  Voltage: 50V  Package: 0805  [C_0805_GEN_1.10H]  (hidden comment: Capacitor)
C68  value 220nF  Voltage: 100V  Package: 0805  [C_0805_GEN_1.40H]  (hidden comment: Capacitor)
C69  SC1V107M6L07KVR  [SC1V107M6L07KVR]
J42  B4B-XH-A(LF)(SN)  [JST_B4B-XH-A(LF)(SN)]
J43  B4B-XH-A(LF)(SN)  [JST_B4B-XH-A(LF)(SN)]
J44  B4B-XH-A(LF)(SN)  [JST_B4B-XH-A(LF)(SN)]
J45  B4B-XH-A(LF)(SN)  [JST_B4B-XH-A(LF)(SN)]
J46  B4B-XH-A(LF)(SN)  [JST_B4B-XH-A(LF)(SN)]
R88  value 22K  Tolerance: 1%  Package: 0805  [R_0805_GEN_0.70H]  (hidden comment: StandardResistor)
R89  value 22K  Tolerance: 1%  Package: 0805  [R_0805_GEN_0.70H]  (hidden comment: StandardResistor)
R90  Package: 0805  [R_0805_GEN_0.70H]  (hidden comment: StandardJumper)
R91  Package: 0805  [R_0805_GEN_0.70H]  (hidden comment: StandardJumper)
R92  value 22K  Tolerance: 1%  Package: 0805  [R_0805_GEN_0.70H]  (hidden comment: StandardResistor)
R93  value 22K  Tolerance: 1%  Package: 0805  [R_0805_GEN_0.70H]  (hidden comment: StandardResistor)
R94  value 1K  Tolerance: 0.1%  Package: 0805  [R_0805_GEN_0.70H]  (hidden comment: StandardResistor)
R95  value 1K  Tolerance: 0.1%  Package: 0805  [R_0805_GEN_0.70H]  (hidden comment: StandardResistor)
R96  value 1K  Tolerance: 0.1%  Package: 0805  [R_0805_GEN_0.70H]  (hidden comment: StandardResistor)
R97  value 1K  Tolerance: 0.1%  Package: 0805  [R_0805_GEN_0.70H]  (hidden comment: StandardResistor)
R98  value 22K  Tolerance: 1%  Package: 0805  [R_0805_GEN_0.70H]  (hidden comment: StandardResistor)
R99  value 22K  Tolerance: 1%  Package: 0805  [R_0805_GEN_0.70H]  (hidden comment: StandardResistor)
R100  Package: 0805  [R_0805_GEN_0.70H]  (hidden comment: StandardJumper)
R101  Package: 0805  [R_0805_GEN_0.70H]  (hidden comment: StandardJumper)
R102  value 22K  Tolerance: 1%  Package: 0805  [R_0805_GEN_0.70H]  (hidden comment: StandardResistor)
R103  value 22K  Tolerance: 1%  Package: 0805  [R_0805_GEN_0.70H]  (hidden comment: StandardResistor)
R104  value 1K  Tolerance: 0.1%  Package: 0805  [R_0805_GEN_0.70H]  (hidden comment: StandardResistor)
R105  value 1K  Tolerance: 0.1%  Package: 0805  [R_0805_GEN_0.70H]  (hidden comment: StandardResistor)
R106  value 1K  Tolerance: 0.1%  Package: 0805  [R_0805_GEN_0.70H]  (hidden comment: StandardResistor)
R107  value 1K  Tolerance: 0.1%  Package: 0805  [R_0805_GEN_0.70H]  (hidden comment: StandardResistor)
R108  value 22K  Tolerance: 1%  Package: 0805  [R_0805_GEN_0.70H]  (hidden comment: StandardResistor)
R109  Package: 0805  [R_0805_GEN_0.70H]  (hidden comment: StandardJumper)
R110  value 22K  Tolerance: 1%  Package: 0805  [R_0805_GEN_0.70H]  (hidden comment: StandardResistor)
R111  value 1K  Tolerance: 0.1%  Package: 0805  [R_0805_GEN_0.70H]  (hidden comment: StandardResistor)
R112  value 1K  Tolerance: 0.1%  Package: 0805  [R_0805_GEN_0.70H]  (hidden comment: StandardResistor)
R140  Package: 0805  [R_0805_GEN_0.70H]  (hidden comment: StandardJumper)
R141  Package: 0805  [R_0805_GEN_0.70H]  (hidden comment: StandardJumper)
R142  Package: 0805  [R_0805_GEN_0.70H]  (hidden comment: StandardJumper)
R143  Package: 0805  [R_0805_GEN_0.70H]  (hidden comment: StandardJumper)
R144  Package: 0805  [R_0805_GEN_0.70H]  (hidden comment: StandardJumper)
R145  Package: 0805  [R_0805_GEN_0.70H]  (hidden comment: StandardJumper)
R146  Package: 0805  [R_0805_GEN_0.70H]  (hidden comment: StandardJumper)
R147  Package: 0805  [R_0805_GEN_0.70H]  (hidden comment: StandardJumper)
R148  Package: 0805  [R_0805_GEN_0.70H]  (hidden comment: StandardJumper)
R149  Package: 0805  [R_0805_GEN_0.70H]  (hidden comment: StandardJumper)
R150  Package: 0805  [R_0805_GEN_0.70H]  (hidden comment: StandardJumper)
R151  Package: 0805  [R_0805_GEN_0.70H]  (hidden comment: StandardJumper)
R152  Package: 0805  [R_0805_GEN_0.70H]  (hidden comment: StandardJumper)
R153  Package: 0805  [R_0805_GEN_0.70H]  (hidden comment: StandardJumper)
R154  Package: 0805  [R_0805_GEN_0.70H]  (hidden comment: StandardJumper)
U5  TMC2209-LA  [QFN50P500X500X90-29N]
U6  TMC2209-LA  [QFN50P500X500X90-29N]
U7  TMC2209-LA  [QFN50P500X500X90-29N]
U8  TMC2209-LA  [QFN50P500X500X90-29N]
U9  TMC2209-LA  [QFN50P500X500X90-29N]

### Blocks framed on the sheet
Y_STEP: C40 C42 C44 C46 C48 C50 J43 R89 R91 R93 R96 R97 R140 R142 R144 U6
X_STEP: C39 C41 C43 C45 C47 C49 J42 R88 R90 R92 R94 R95 R141 R143 R145 U5
E1_STEP: C63 C65-C69 J46 R108-R112 R146-R148 U9
E0_STEP: C52 C54 C56 C58 C60 C62 J45 R99 R101 R103 R106 R107 R149 R151 R153 U8
Z_STEP: C51 C53 C55 C57 C59 C61 J44 R98 R100 R102 R104 R105 R150 R152 R154 U7

### Ports
+3V3, +24VA, E0_DIR, E0_EN, E0_STEP, E0_UART, E0DIAG, E1_DIR, E1_EN, E1_STEP, E1_UART, E1DIAG, X_DIR, X_EN, X_STEP, X_UART, XDIAG, Y_DIR, Y_EN, Y_STEP, Y_UART, YDIAG, Z_DIR, Z_EN, Z_STEP, Z_UART, ZDIAG

### Nets
+3.3V: C43.1 C44.1 C55.1 C56.1 C66.1 R88.2 R89.2 R98.2 R99.2 R108.2 U5.15(VCC_IO) U6.15(VCC_IO) U7.15(VCC_IO) U8.15(VCC_IO) U9.15(VCC_IO) ; port +3V3  [project net +3V3]
+24VA: C41.2 C42.2 C47.1 C48.1 C49.1 C50.1 C53.2 C54.2 C59.1 C60.1 C61.1 C62.1 C65.2 C68.1 C69.1 U5.22(VS) U5.28(VS) U6.22(VS) U6.28(VS) U7.22(VS) U7.28(VS) U8.22(VS) U8.28(VS) U9.22(VS) U9.28(VS) ; port +24VA
GND: C39.2 C40.2 C43.2 C44.2 C47.2 C48.2 C49.2 C50.2 C51.2 C52.2 C55.2 C56.2 C59.2 C60.2 C61.2 C62.2 C63.2 C66.2 C68.2 C69.2 R90.1 R91.1 R92.2 R93.2 R94.1 R95.1 R96.1 R97.1 R100.1 R101.1 R102.2 R103.2 R104.1 R105.1 R106.1 R107.1 R109.1 R110.2 R111.1 R112.1 U5.3(GND) U5.18(GND) U5.29(EXP) U6.3(GND) U6.18(GND) U6.29(EXP) U7.3(GND) U7.18(GND) U7.29(EXP) U8.3(GND) U8.18(GND) U8.29(EXP) U9.3(GND) U9.18(GND) U9.29(EXP)
E0_DIR: R153.1 ; port E0_DIR
E0_DIR1: R153.2 U8.19(DIR)
E0_EN: R149.1 ; port E0_EN
E0_EN1: R99.1 R149.2 U8.2(~{EN})
E0_STEP: R151.1 ; port E0_STEP
E0_STEP1: R151.2 U8.16(STEP)
E0_UART: R103.1 U8.14(~{PD}_UART) ; port E0_UART
E0DIAG: U8.11(DIAG) ; port E0DIAG
E1_DIR: R148.1 ; port E1_DIR
E1_DIR1: R148.2 U9.19(DIR)
E1_EN: R146.1 ; port E1_EN
E1_EN1: R108.1 R146.2 U9.2(~{EN})
E1_STEP: R147.1 ; port E1_STEP
E1_STEP1: R147.2 U9.16(STEP)
E1_UART: R110.1 U9.14(~{PD}_UART) ; port E1_UART
E1DIAG: U9.11(DIAG) ; port E1DIAG
X_DIR: R145.1 ; port X_DIR
X_DIR1: R145.2 U5.19(DIR)
X_EN: R141.1 ; port X_EN
X_EN1: R88.1 R141.2 U5.2(~{EN})
X_STEP: R143.1 ; port X_STEP
X_STEP1: R143.2 U5.16(STEP)
X_UART: R92.1 U5.14(~{PD}_UART) ; port X_UART
XDIAG: U5.11(DIAG) ; port XDIAG
Y_DIR: R144.1 ; port Y_DIR
Y_DIR1: R144.2 U6.19(DIR)
Y_EN: R140.1 ; port Y_EN
Y_EN1: R89.1 R140.2 U6.2(~{EN})
Y_STEP: R142.1 ; port Y_STEP
Y_STEP1: R142.2 U6.16(STEP)
Y_UART: R93.1 U6.14(~{PD}_UART) ; port Y_UART
YDIAG: U6.11(DIAG) ; port YDIAG
Z_DIR: R154.1 ; port Z_DIR
Z_DIR1: R154.2 U7.19(DIR)
Z_EN: R150.1 ; port Z_EN
Z_EN1: R98.1 R150.2 U7.2(~{EN})
Z_STEP: R152.1 ; port Z_STEP
Z_STEP1: R152.2 U7.16(STEP)
Z_UART: R102.1 U7.14(~{PD}_UART) ; port Z_UART
ZDIAG: U7.11(DIAG) ; port ZDIAG
NetC39_1: C39.1 U5.8(5VOUT)
NetC40_1: C40.1 U6.8(5VOUT)
NetC41_1: C41.1 U5.6(VCP)
NetC42_1: C42.1 U6.6(VCP)
NetC45_1: C45.1 U5.4(CPO)
NetC45_2: C45.2 U5.5(CPI)
NetC46_1: C46.1 U6.4(CPO)
NetC46_2: C46.2 U6.5(CPI)
NetC51_1: C51.1 U7.8(5VOUT)
NetC52_1: C52.1 U8.8(5VOUT)
NetC53_1: C53.1 U7.6(VCP)
NetC54_1: C54.1 U8.6(VCP)
NetC57_1: C57.1 U7.4(CPO)
NetC57_2: C57.2 U7.5(CPI)
NetC58_1: C58.1 U8.4(CPO)
NetC58_2: C58.2 U8.5(CPI)
NetC63_1: C63.1 U9.8(5VOUT)
NetC65_1: C65.1 U9.6(VCP)
NetC67_1: C67.1 U9.4(CPO)
NetC67_2: C67.2 U9.5(CPI)
NetJ42_1: J42.1 U5.21(OA2)
NetJ42_2: J42.2 U5.24(OA1)
NetJ42_3: J42.3 U5.26(OB1)
NetJ42_4: J42.4 U5.1(OB2)
NetJ43_1: J43.1 U6.21(OA2)
NetJ43_2: J43.2 U6.24(OA1)
NetJ43_3: J43.3 U6.26(OB1)
NetJ43_4: J43.4 U6.1(OB2)
NetJ44_1: J44.1 U7.21(OA2)
NetJ44_2: J44.2 U7.24(OA1)
NetJ44_3: J44.3 U7.26(OB1)
NetJ44_4: J44.4 U7.1(OB2)
NetJ45_1: J45.1 U8.21(OA2)
NetJ45_2: J45.2 U8.24(OA1)
NetJ45_3: J45.3 U8.26(OB1)
NetJ45_4: J45.4 U8.1(OB2)
NetJ46_1: J46.1 U9.21(OA2)
NetJ46_2: J46.2 U9.24(OA1)
NetJ46_3: J46.3 U9.26(OB1)
NetJ46_4: J46.4 U9.1(OB2)
NetR90_2: R90.2 U5.13(CLK)
NetR91_2: R91.2 U6.13(CLK)
NetR94_2: R94.2 U5.27(BRB)
NetR95_2: R95.2 U5.23(BRA)
NetR96_2: R96.2 U6.27(BRB)
NetR97_2: R97.2 U6.23(BRA)
NetR100_2: R100.2 U7.13(CLK)
NetR101_2: R101.2 U8.13(CLK)
NetR104_2: R104.2 U7.27(BRB)
NetR105_2: R105.2 U7.23(BRA)
NetR106_2: R106.2 U8.27(BRB)
NetR107_2: R107.2 U8.23(BRA)
NetR109_2: R109.2 U9.13(CLK)
NetR111_2: R111.2 U9.27(BRB)
NetR112_2: R112.2 U9.23(BRA)

Not connected (* = marked no-connect by the designer): U5 7(SPREAD)* 9(MS1_AD0)* 10(MS2_AD1)* 12(INDEX)* 17(VREF)* 20(STDBY)* 25(NC)*; U6 7(SPREAD)* 9(MS1_AD0)* 10(MS2_AD1)* 12(INDEX)* 17(VREF)* 20(STDBY)* 25(NC)*; U7 7(SPREAD)* 9(MS1_AD0)* 10(MS2_AD1)* 12(INDEX)* 17(VREF)* 20(STDBY)* 25(NC)*; U8 7(SPREAD)* 9(MS1_AD0)* 10(MS2_AD1)* 12(INDEX)* 17(VREF)* 20(STDBY)* 25(NC)*; U9 7(SPREAD)* 9(MS1_AD0)* 10(MS2_AD1)* 12(INDEX)* 17(VREF)* 20(STDBY)* 25(NC)*

### Notes on the sheet
- POWER

### Library data of the parts
C39 C40 C51 C52 C63 = CER_2.2uF_#1: CAP_CER_2.2uF_16V_X7R_10%_0805; Manufacturer#1: Kemet; Manufacturer#1 PN: C0805C225K4RACAUTO; Manufacturer#2 PN: GCM21BR71C225KA64L; Similar Part: CGA4J3X7R1C225K125AB; Added by: SonerI; FireANTs Code: C00051; Grade Level: Automotive; Lead Status: Pb-Free; Location: 3C13; Max Reflow Duration: 30; Max Reflow Temp: 260; Placement Area: 10.45; Power Rating: X; Temp# Operating: -55°C/+125°C; Tolerance: 10%; Identifier: CER_2.2uF_#1; Checked by: İlkerU; ComponentLink1Description: Resource Folder; ComponentLink1URL: C:\FireANTs_Repo\HW_Lib\trunk\ComponentLibrary\Resources\Capacitors\C00051; Cost: 0.41; Current: N/A; Failure in Time: N/A; Features: AEC-Q200; Height: 1.40; Manufacturer#2: Murata; MSL: 1; Mounting Type: SMD; Part Status: Active; Temp# Storage: N/A; Weight: 19mg
C41-C44 C47 C48 C53-C56 C59 C60 C65 C66 C68 = CER_220nF_#9: CAP_CER_220nF_100V_X7R_10%_0805; Manufacturer#1: Kemet; Manufacturer#1 PN: C0805C224K1RECAUTO; Manufacturer#2 PN: HMJ212BB7224KGHT; Similar Part: CC0805KKX7R0BB224; GRM21AR72A224KAC5L; Added by: YasinY; FireANTs Code: C00131; Grade Level: Automotive; Lead Status: Pb-Free; Location: 3G8; Max Reflow Duration: 30; Max Reflow Temp: 260; Placement Area: 10.45; Power Rating: X; Temp# Operating: -55°C/+125°C; Tolerance: 10%; Identifier: CER_220nF_#9; Checked by: İlkerU; ComponentLink1Description: Resource Folder; ComponentLink1URL: C:\FireANTs_Repo\HW_Lib\trunk\ComponentLibrary\Resources\Capacitors\C00131; Cost: 0.30; Current: N/A; Failure in Time: N/A; Features: AEC-Q200; Height: 1.40; Manufacturer#2: Taiyo Yuden; MSL: 1; Mounting Type: SMD; Part Status: Active; Temp# Storage: N/A; Weight: 19mg
C45 C46 C57 C58 C67 = CER_10nF_#1: CAP_CER_10nF_50V_NP0_5%_0805; Manufacturer#1: Murata; Manufacturer#1 PN: GCM2195C1H103JA16D; Manufacturer#2 PN: C0805C103J5GACAUTO; Similar Part: CGA4C2C0G1H103J060AA; Added by: SonerI; FireANTs Code: C00074; Grade Level: Automotive; Lead Status: Pb-Free; Location: 3B19; Max Reflow Duration: 30; Max Reflow Temp: 260; Placement Area: 10.45; Power Rating: X; Temp# Operating: -55°C/+125°C; Tolerance: 5%; Identifier: CER_10nF_#1; Checked by: İlkerU; ComponentLink1Description: Resource Folder; ComponentLink1URL: C:\FireANTs_Repo\HW_Lib\trunk\ComponentLibrary\Resources\Capacitors\C00074; Cost: 0.47; Current: N/A; Failure in Time: N/A; Features: AEC-Q200; Height: 1.10; Manufacturer#2: Kemet; MSL: 1; Mounting Type: SMD; Part Status: Not For New Designs; Temp# Storage: N/A; Weight: 17mg
R88 R89 R92 R93 R98 R99 R102 R103 R108 R110 = STD_22K_#3: RES_STD_22K_0.125W_1%_100ppm_0805; Manufacturer#1: Yageo; Manufacturer#1 PN: AC0805FR-0722KL; Manufacturer#2 PN: ERJ-6ENF2202V; Added by: SonerI; FireANTs Code: R00064; Current: X; Grade Level: Automotive; Lead Status: Pb-Free; Location: 2D16; Max Reflow Duration: 10; Max Reflow Temp: 260; Placement Area: 10.45; Power Rating: 125mW; Temp# Operating: -55°C/+155°C; Voltage: 150V; Identifier: STD_22K_#3; Checked by: YasinY; ComponentLink1Description: Resource Folder; ComponentLink1URL: C:\FireANTs_Repo\HW_Lib\trunk\ComponentLibrary\Resources\Resistors\R00064; Cost: 0.10; Failure in Time: N/A; Features: AEC-Q200; Height: 0.70; Manufacturer#2: Panasonic; MSL: 1; Mounting Type: SMD; Part Status: Active; Similar Part: N/A; Temp# Storage: N/A; Weight: 5.5mg
R90 R91 R100 R101 R109 R140-R154 = STD_JUMPER_#3: as R155 on sheet Printing2; Identifier: STD_JUMPER_#3; Checked by: YasinY; ComponentLink1Description: Resource Folder; ComponentLink1URL: C:\FireANTs_Repo\HW_Lib\trunk\ComponentLibrary\Resources\Resistors\R00008; Cost: 0.10; Failure in Time: N/A; Features: AEC-Q200; Height: 0.70; Manufacturer#2: Panasonic; MSL: 1; Mounting Type: SMD; Part Status: Active; Similar Part: N/A; Temp# Storage: N/A; Weight: 5.5mg
R94-R97 R104-R107 R111 R112 = STD_1K_#6: RES_STD_1K_0.125W_0.1%_25ppm_0805; Manufacturer#1: Panasonic; Manufacturer#1 PN: ERA-6AEB102V; Manufacturer#2 PN: RG2012P-102-B-T5; Similar Part: RN73C2A1K0BTD; Added by: İlhanT; FireANTs Code: R00085; Current: X; Grade Level: Automotive; Lead Status: Pb-Free; Location: 2A22; Max Reflow Duration: 10; Max Reflow Temp: 260; Placement Area: 10.45; Power Rating: 125mW; Temp# Operating: -55°C/+155°C; Voltage: 100V; Identifier: STD_1K_#6; Checked by: YasinY; ComponentLink1Description: Resource Folder; ComponentLink1URL: C:\FireANTs_Repo\HW_Lib\trunk\ComponentLibrary\Resources\Resistors\R00085; Cost: 0.31; Failure in Time: N/A; Features: AEC-Q200; Height: 0.70; Manufacturer#2: Susumu; MSL: 1; Mounting Type: SMD; Part Status: Active; Temp# Storage: N/A; Weight: 5.5mg
U5-U9 = TMC2209-LA: Motor / Motion / Ignition Controllers & Drivers Stepper Motor Driver/Controller, 4.75-28V, 2.0A, Step/Dir, QFN28; MF: Trinamic; Package: VFQFN-28 Trinamic; SnapEDA_Link: https://www.snapeda.com/parts/TMC2209-LA/Trinamic/view-part/?ref=snap; MP: TMC2209-LA; Value: *; Availability: In Stock; Price: None; Purchase-URL: https://pricing.snapeda.com/search/part/TMC2209-LA/?ref=eda; Check_prices: https://www.snapeda.com/parts/TMC2209-LA/Trinamic/view-part/?ref=eda
J42-J46 = B4B-XH-A(LF)(SN): Price: None; MP: B4B-XH-A(LF)(SN); Value: *; Availability: Unavailable; Package: None